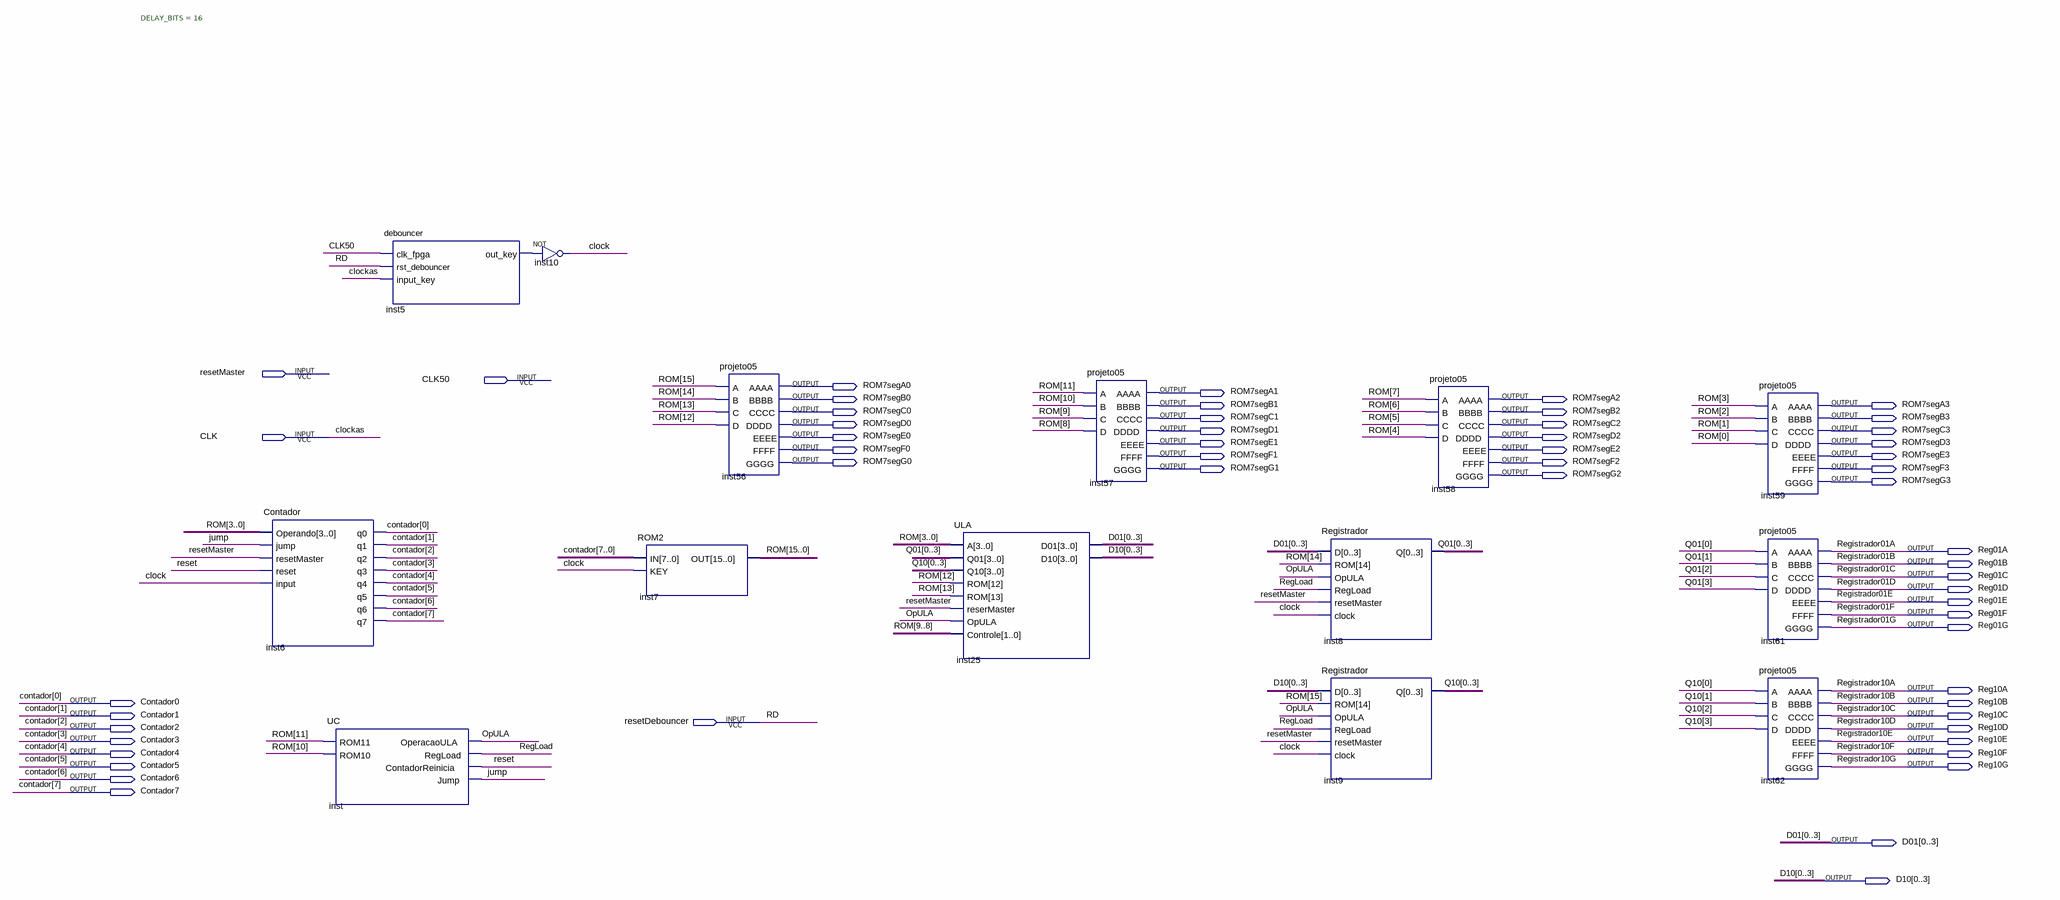
[diagram p0: schematic sheet]
// Quartus schematic CPU.bdf as structural Verilog: 14 symbols, 56 pins
module CPU (
  input  resetMaster,
  input  CLK50,
  input  CLK,
  input  resetDebouncer,
  output ROM7segA0,
  output ROM7segA1,
  output ROM7segB0,
  output ROM7segA2,
  output ROM7segB1,
  output ROM7segA3,
  output ROM7segC0,
  output ROM7segB2,
  output ROM7segC1,
  output ROM7segB3,
  output ROM7segD0,
  output ROM7segC2,
  output ROM7segD1,
  output ROM7segC3,
  output ROM7segE0,
  output ROM7segD2,
  output ROM7segE1,
  output ROM7segD3,
  output ROM7segF0,
  output ROM7segE2,
  output ROM7segF1,
  output ROM7segE3,
  output ROM7segG0,
  output ROM7segF2,
  output ROM7segG1,
  output ROM7segF3,
  output ROM7segG2,
  output ROM7segG3,
  output Reg01A,
  output Reg01B,
  output Reg01C,
  output Reg01D,
  output Reg01E,
  output Reg01F,
  output Reg01G,
  output Reg10A,
  output Contador0,
  output Reg10B,
  output Contador1,
  output Reg10C,
  output Contador2,
  output Reg10D,
  output Contador3,
  output Reg10E,
  output Contador4,
  output Reg10F,
  output Contador5,
  output Reg10G,
  output Contador6,
  output Contador7,
  output [0:3] D01,
  output [0:3] D10
);

  wire clock, inst5_out_key, jump, OpULA, RegLoad, reset;
  wire [3:0] Q01, Q10;
  wire [15:0] ROM;

  Contador inst6 (
    .Operando(ROM[3:0]), .jump(jump), .resetMaster(resetMaster), .reset(reset), .\input (clock),
    .q0(Contador0), .q1(Contador1), .q2(Contador2), .q3(Contador3), .q4(Contador4), .q5(Contador5),
    .q6(Contador6), .q7(Contador7));
  UC inst (
    .ROM11(ROM[11]), .ROM10(ROM[10]), .OperacaoULA(OpULA), .RegLoad(RegLoad), .ContadorReinicia(reset),
    .Jump(jump));
  debouncer #(.DELAY_BITS(16)) inst5 (
    .clk_fpga(CLK50), .rst_debouncer(resetDebouncer), .input_key(CLK), .out_key(inst5_out_key));
  not inst10 (clock, inst5_out_key);
  ROM2 inst7 (
    .IN({Contador7, Contador6, Contador5, Contador4, Contador3, Contador2, Contador1, Contador0}),
    .KEY(clock), .OUT(ROM));
  projeto05 inst56 (
    .A(ROM[15]), .B(ROM[14]), .C(ROM[13]), .D(ROM[12]), .AAAA(ROM7segA0), .BBBB(ROM7segB0), .CCCC(ROM7segC0),
    .DDDD(ROM7segD0), .EEEE(ROM7segE0), .FFFF(ROM7segF0), .GGGG(ROM7segG0));
  ULA inst25 (
    .A(ROM[3:0]), .Q01({Q01[0], Q01[1], Q01[2], Q01[3]}), .Q10({Q10[0], Q10[1], Q10[2], Q10[3]}),
    .ROM(ROM[13:12]), .reserMaster(resetMaster), .OpULA(OpULA), .Controle(ROM[9:8]), .D01(D01), .D10(D10));
  projeto05 inst57 (
    .A(ROM[11]), .B(ROM[10]), .C(ROM[9]), .D(ROM[8]), .AAAA(ROM7segA1), .BBBB(ROM7segB1), .CCCC(ROM7segC1),
    .DDDD(ROM7segD1), .EEEE(ROM7segE1), .FFFF(ROM7segF1), .GGGG(ROM7segG1));
  Registrador inst8 (
    .D(D01), .ROM(ROM[14]), .OpULA(OpULA), .RegLoad(RegLoad), .resetMaster(resetMaster), .clock(clock),
    .Q({Q01[0], Q01[1], Q01[2], Q01[3]}));
  Registrador inst9 (
    .D(D10), .ROM(ROM[15]), .OpULA(OpULA), .RegLoad(RegLoad), .resetMaster(resetMaster), .clock(clock),
    .Q({Q10[0], Q10[1], Q10[2], Q10[3]}));
  projeto05 inst58 (
    .A(ROM[7]), .B(ROM[6]), .C(ROM[5]), .D(ROM[4]), .AAAA(ROM7segA2), .BBBB(ROM7segB2), .CCCC(ROM7segC2),
    .DDDD(ROM7segD2), .EEEE(ROM7segE2), .FFFF(ROM7segF2), .GGGG(ROM7segG2));
  projeto05 inst59 (
    .A(ROM[3]), .B(ROM[2]), .C(ROM[1]), .D(ROM[0]), .AAAA(ROM7segA3), .BBBB(ROM7segB3), .CCCC(ROM7segC3),
    .DDDD(ROM7segD3), .EEEE(ROM7segE3), .FFFF(ROM7segF3), .GGGG(ROM7segG3));
  projeto05 inst61 (
    .A(Q01[0]), .B(Q01[1]), .C(Q01[2]), .D(Q01[3]), .AAAA(Reg01A), .BBBB(Reg01B), .CCCC(Reg01C),
    .DDDD(Reg01D), .EEEE(Reg01E), .FFFF(Reg01F), .GGGG(Reg01G));
  projeto05 inst62 (
    .A(Q10[0]), .B(Q10[1]), .C(Q10[2]), .D(Q10[3]), .AAAA(Reg10A), .BBBB(Reg10B), .CCCC(Reg10C),
    .DDDD(Reg10D), .EEEE(Reg10E), .FFFF(Reg10F), .GGGG(Reg10G));

  // Other names for the same wires on the sheet: clockas = CLK; RD = resetDebouncer; Registrador01A = Reg01A;
  //   Registrador01B = Reg01B; Registrador01C = Reg01C; Registrador01D = Reg01D; Registrador01E = Reg01E;
  //   Registrador01F = Reg01F; Registrador01G = Reg01G; Registrador10A = Reg10A; Registrador10B = Reg10B;
  //   Registrador10C = Reg10C; Registrador10D = Reg10D; Registrador10E = Reg10E; Registrador10F = Reg10F;
  //   Registrador10G = Reg10G
endmodule
